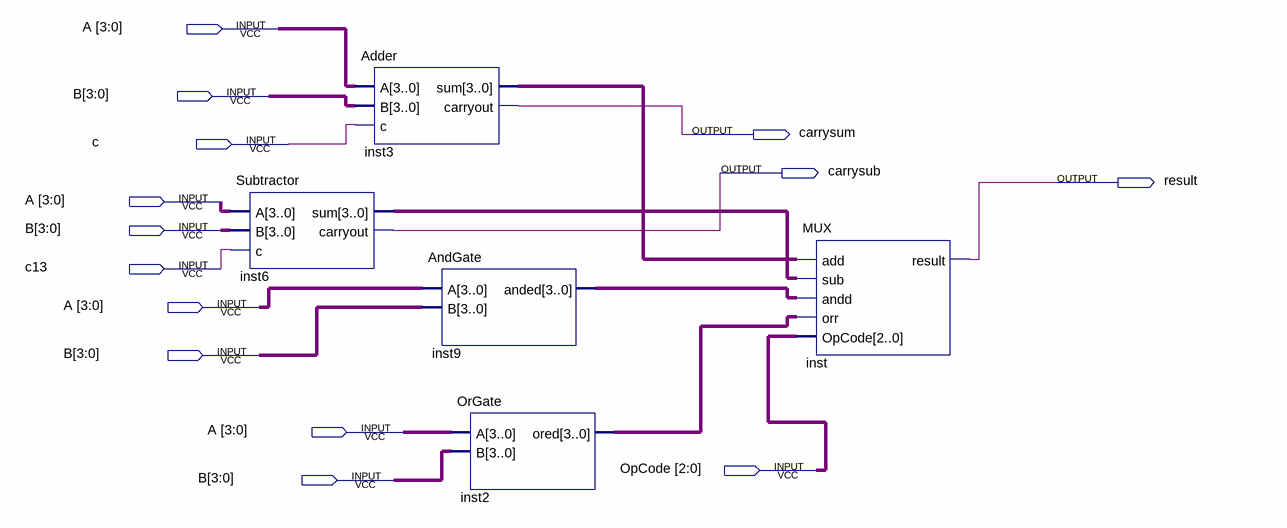
[diagram p0: schematic sheet]
// Quartus schematic with mux.bdf as structural Verilog: 5 symbols, 14 pins
module \with_mux  (
  input  [3:0] A,
  input  [3:0] B,
  input  c,
  input  c13,
  input  [2:0] OpCode,
  output carrysum,
  output carrysub,
  output result
);

  wire [3:0] inst2_ored, inst3_sum, inst6_sum, inst9_anded;

  Subtractor inst6 (.A(A), .B(B), .c(c13), .sum(inst6_sum), .carryout(carrysub));
  Adder inst3 (.A(A), .B(B), .c(c), .sum(inst3_sum), .carryout(carrysum));
  AndGate inst9 (.A(A), .B(B), .anded(inst9_anded));
  OrGate inst2 (.A(A), .B(B), .ored(inst2_ored));
  MUX inst (.add(inst3_sum), .sub(inst6_sum), .andd(inst9_anded), .orr(inst2_ored), .OpCode(OpCode), .result(result));
endmodule
